# Altium project MB1180.PrjPCB
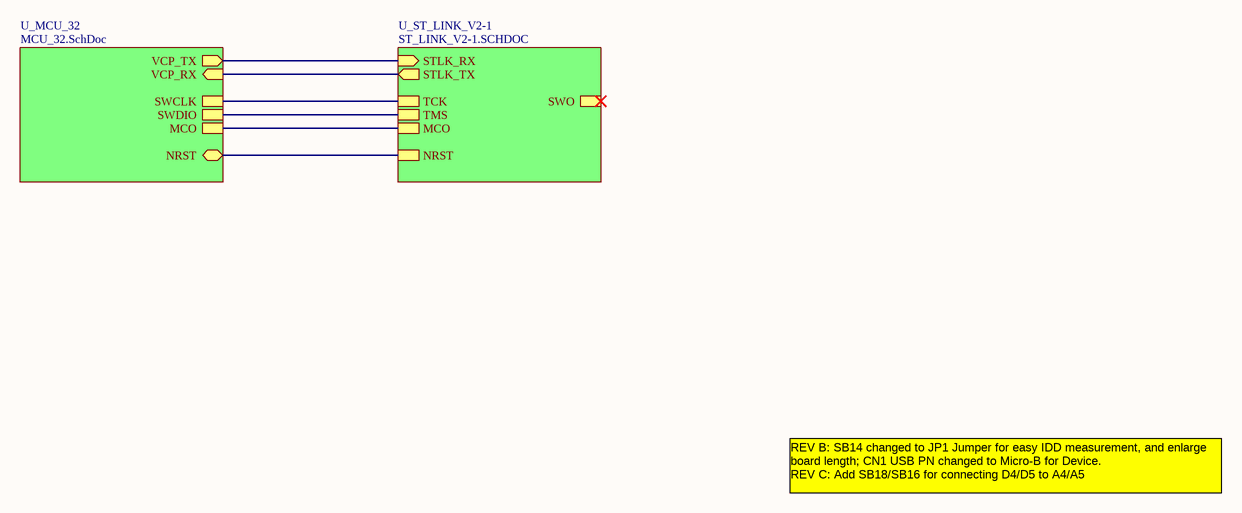
[diagram p0: MB1180.SchDoc]
3 sheets, 89 parts. Net scope: hierarchical (ports join the sheet entries above them; power ports are global).
Board file: MB1180.PcbDoc
Sheets:
  MB1180.SchDoc
    U_MCU_32 = MCU_32.SchDoc
    U_ST_LINK_V2-1 = ST_LINK_V2-1.SCHDOC

## Sheet MB1180.SchDoc: TOP
size A4; DocumentNumber: MB1180; Revision: C.1; SheetNumber: 1; SheetTotal: 3; Project: NUCLEO32

### Sub-sheets
U_MCU_32 = MCU_32.SchDoc: MCO, VCP_TX (out), SWCLK, SWDIO, VCP_RX (in), NRST
U_ST_LINK_V2-1 = ST_LINK_V2-1.SCHDOC: TMS, TCK, MCO, NRST, STLK_RX (in), STLK_TX (out), SWO

### Nets
MCO: sheet U_MCU_32/MCO, sheet U_ST_LINK_V2-1/MCO
NRST: sheet U_MCU_32/NRST, sheet U_ST_LINK_V2-1/NRST
PA2: sheet U_MCU_32/VCP_TX, sheet U_ST_LINK_V2-1/STLK_RX
PA13: sheet U_MCU_32/SWDIO, sheet U_ST_LINK_V2-1/TMS
PA14: sheet U_MCU_32/SWCLK, sheet U_ST_LINK_V2-1/TCK
PA15: sheet U_MCU_32/VCP_RX, sheet U_ST_LINK_V2-1/STLK_TX

### Notes on the sheet
- REV B: SB14 changed to JP1 Jumper for easy IDD measurement, and enlarge board length; CN1 USB PN changed to Micro-B for Device.
  REV C: Add SB18/SB16 for connecting D4/D5 to A4/A5
- Title:
- Project:
- Size:
- Date:
- A4
- Reference:
- Sheet:
- Revision:
- of

## Sheet MCU_32.SchDoc: MCU
size A4; DocumentNumber: MB1180; Revision: C.1; SheetNumber: 2; SheetTotal: 3; Project: NUCLEO32
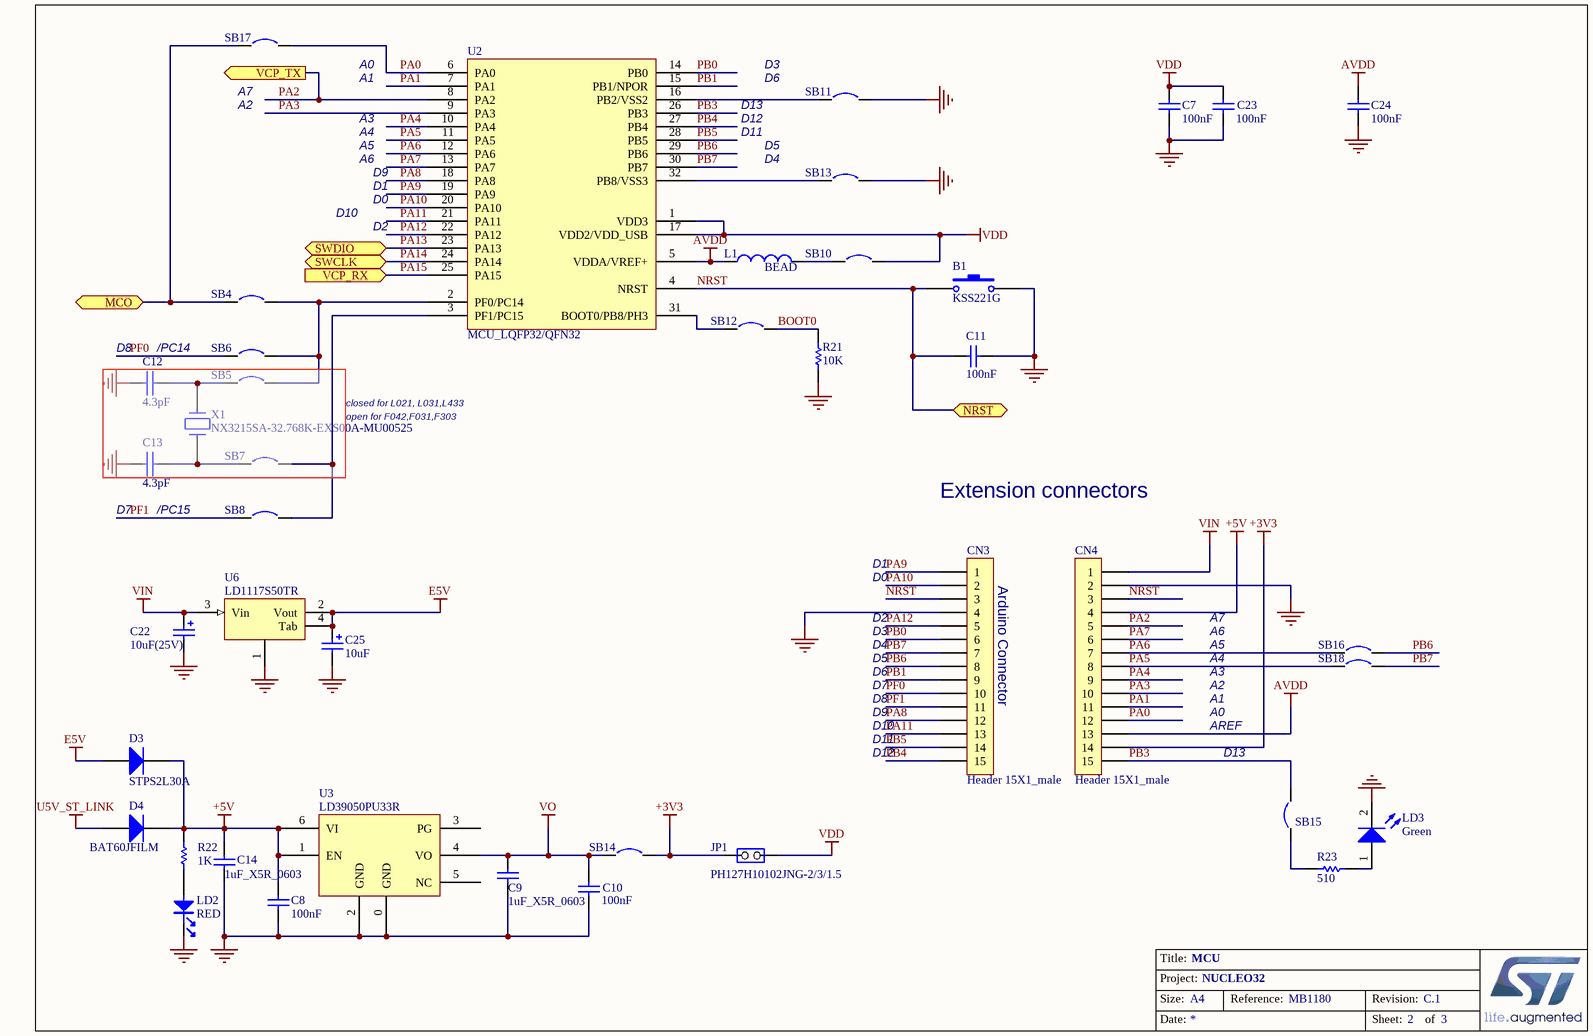
[diagram p1: MCU_32.SchDoc]

### Parts
B1  KSS221G  [SW2_5R6_5R5x3R1]
C7  100nF  [0603C]
C8  100nF  [0603C]
C9  1uF_X5R_0603  [0603C]
C10  100nF  [0603C]
C11  100nF  [0603C]
C12  4.3pF  [0603C]
C13  4.3pF  [0603C]
C14  1uF_X5R_0603  [0603C]
C22  10uF(25V)  [TAN_B]
C23  100nF  [0603C]
C24  100nF  [0603C]
C25  10uF  [TAN_A]
CN3  Header 15X1_male  [HDR_1x15_2R54_V_F]
CN4  Header 15X1_male  [HDR_1x15_2R54_V_F]
D3  STPS2L30A  [SMA]
D4  BAT60JFILM  [SOD-323]
JP1  PH127H10102JNG-2/3/1.5  [HDR_1x2_1R27_R_M]
L1  BEAD  [0603L]
LD2  RED  [0603D_R]
LD3  Green  [0603D_G]
R21  10K  [0603R]
R22  1K  [0603R]
R23  510  [0603R]
SB4  Circuit Breaker (open)  [SB_0603]  (value not drawn)
SB5  Circuit Breaker  [SB_0603]  (value not drawn)
SB6  Circuit Breaker  [SB_0603]  (value not drawn)
SB7  Circuit Breaker  [SB_0603]  (value not drawn)
SB8  Circuit Breaker  [SB_0603]  (value not drawn)
SB10  Circuit Breaker (close)  [SB_0603]  (value not drawn)
SB11  Circuit Breaker (close)  [SB_0603]  (value not drawn)
SB12  Circuit Breaker (close)  [SB_0603]  (value not drawn)
SB13  Circuit Breaker (close)  [SB_0603]  (value not drawn)
SB14  Circuit Breaker (close)  [SB_0603]  (value not drawn)
SB15  Circuit Breaker (close)  [SB_0603]  (value not drawn)
SB16  Circuit Breaker (close)  [SB_0603]  (value not drawn)
SB17  Circuit Breaker (open)  [SB_0603]  (value not drawn)
SB18  Circuit Breaker (close)  [SB_0603]  (value not drawn)
U2  MCU_LQFP32/QFN32  [LQFP32_0R5_7x7]
U3  LD39050PU33R  [DFN6_0R95_3x3_TP]
U6  LD1117S50TR  [SOT-223]
X1  NX3215SA-32.768K-EXS00A-MU00525  [XTAL_2SM_3R2X1R5]

### Ports
MCO, NRST, SWCLK, SWDIO, VCP_RX (in), VCP_TX (out)

### Nets
+3V3: CN4.14 JP1.1(COMMON) SB14.2
+5V: C8.2 C14.1 CN4.4 D3.2(K) D4.2(K) R22.2 U3.1(EN) U3.6(VI)
AVDD: C24.1 CN4.13 L1.1 U2.5(VDDA/VREF+)
E5V: C25.1 D3.1(A) U6.2(Vout) U6.4(Tab)
GND: B1.2 C7.2 C8.1 C9.2 C10.1 C11.1 C12.2 C13.2 C14.2 C22.2 C23.2 C24.2 C25.2 CN3.4 CN4.2 LD2.2 LD3.2(K) R21.2 SB11.2 SB13.2 U3.0(GND) U3.2(GND) U6.1
U5V_ST_LINK: D4.1(A)
VDD: C7.1 C23.1 JP1.2(NO) SB10.2 U2.1(VDD3) U2.17(VDD2/VDD_USB)
VIN: C22.1 CN4.1 U6.3(Vin)
VO: C9.1 C10.2 SB14.1 U3.4(VO)
BOOT0: R21.1 SB12.2
MCO: SB4.1 SB17.1 ; port MCO
NRST: B1.1 C11.2 CN3.3 CN4.3 U2.4(NRST) ; port NRST
PA0: CN4.12 SB17.2 U2.6(PA0)
PA1: CN4.11 U2.7(PA1)
PA2: CN4.5 U2.8(PA2) ; port VCP_TX
PA3: CN4.10 U2.9(PA3)
PA4: CN4.9 U2.10(PA4)
PA5: CN4.8 SB18.1 U2.11(PA5)
PA6: CN4.7 SB16.1 U2.12(PA6)
PA7: CN4.6 U2.13(PA7)
PA8: CN3.12 U2.18(PA8)
PA9: CN3.1 U2.19(PA9)
PA10: CN3.2 U2.20(PA10)
PA11: CN3.13 U2.21(PA11)
PA12: CN3.5 U2.22(PA12)
PA13: U2.23(PA13) ; port SWDIO
PA14: U2.24(PA14) ; port SWCLK
PA15: U2.25(PA15) ; port VCP_RX
PB0: CN3.6 U2.14(PB0)
PB1: CN3.9 U2.15(PB1/NPOR)
PB3: CN4.15 SB15.2 U2.26(PB3)
PB4: CN3.15 U2.27(PB4)
PB5: CN3.14 U2.28(PB5)
PB6: CN3.8 SB16.2 U2.29(PB6)
PB7: CN3.7 SB18.2 U2.30(PB7)
PF0: CN3.10 SB6.1
PF1: CN3.11 SB8.1
NetC12_1: C12.1 SB5.1 X1.1
NetC13_1: C13.1 SB7.1 X1.2
NetL1_2: L1.2 SB10.1
NetLD2_1: LD2.1 R22.1
NetLD3_1: LD3.1(A) R23.1
NetR23_2: R23.2 SB15.1
NetSB4_2: SB4.2 SB5.2 SB6.2 U2.2(PF0/PC14)
NetSB7_2: SB7.2 SB8.2 U2.3(PF1/PC15)
NetSB11_1: SB11.1 U2.16(PB2/VSS2)
NetSB12_1: SB12.1 U2.31(BOOT0/PB8/PH3)
NetSB13_1: SB13.1 U2.32(PB8/VSS3)

Not connected (* = marked no-connect by the designer): U3 3(PG) 5(NC)

### Notes on the sheet
- A2
- (near SB17) A7
- A0
- A1
- D3
- (near SB11) D13
- D6
- A3
- A5
- A6
- A4
- D9
- D4
- D11
- D12
- D5
- D10
- D0
- D1
- D2
- (near C12) D8
- (near C12) /PC14
- closed for L021, L031,L433
- open for F042,F031,F303
- (near C13) D7
- /PC15
- Extension connectors
- (near CN3) Arduino Connector
- A7
- D7
- D8
- AREF
- D13
- Title:
- Project:
- Size:
- Date:
- Reference:
- Sheet:
- Revision:
- of

### Library data of the parts
B1 = SW-PB: Switch; Published: 24-Mar-1999; LatestRevisionDate: 17-Jul-2002; LatestRevisionNote: Re-released for DXP Platform.; PackageReference: SPST-2; Publisher: Altium Limited
C7 C23 C24 = Cap: Capacitor; Value: 10nF; Published: 8-Jun-2000; Revision: July-2002: Re-released for DXP Platform.; Publisher: Altium Limited
C8 C10 = Capacitor_ST: Capacitor 0402 / 0603 / 0805; Revision: July-2002: Re-released for DXP Platform.; Value: 100nF
C9 C14 = CAP SMD 0603  X5R 1µF 25V 10%: 0603  X5R 1µF; Rated voltage: 25V; Tolerance: 10%; Manufacturer: *; Manufacturer P/N: *; Order code Farnell: 1288202RL; Value: 1µF; Power: *; Technology: X5R; Temperature  Factor: *; Temperature Max: +125°C; Temperature Min: -55°C; STS Code: *
C11 = CAP: Capacitor; Value: 100pF; Published: 8-Jun-2000; Revision: July-2002: Re-released for DXP Platform.; Publisher: Altium Limited
C12 C13 = CAP: Capacitor
C22 C25 = Cap Pol1: Polarized Capacitor (Radial); Published: 8-Jun-2000; Revision: July-2002: Re-released for DXP Platform.; Publisher: Altium Limited; Value: 10uF
CN3 CN4 = Header 15X1_Female_1: Header, 10-Pin, Single row,female; LatestRevisionDate: 17-Jul-2002; LatestRevisionNote: Re-released for DXP Platform.; Publisher: Altium Limited
D3 = STPS2L30A: Manuf_1: STM; Provided: ST; Order: BAT60JFILM; ECCN_US/EU: EAR99/NEC; Revision: July-2002: Re-released for DXP Platform.; Manuf_Part_1: BAT60JFILM; Distrib: ST
D4 = BAT60JFILM: Manuf_1: STM; Provided: ST; ECCN_US/EU: EAR99/NEC; Revision: July-2002: Re-released for DXP Platform.; Order: BAT60JFILM; Manuf_Part_1: BAT60JFILM; Distrib: ST
JP1 = JP2
L1 = Inductor: Value: 100uH; Published: 8-Jun-2000; Revision: July-2002: Re-released for DXP Platform.; Publisher: Altium Limited
LD2 = PHOTO
LD3 = LED2: Typical RED, GREEN, YELLOW, AMBER GaAs LED; Published: 8-Jun-2000; Revision: July-2002: Re-released for DXP Platform.; Publisher: Altium Limited
R21 = res1: Resistor; Value: 1K; Published: 8-Jun-2000; Revision: July-2002: Re-released for DXP Platform.; Publisher: Altium Limited
R22 = Resistor_ST: Resistor 0402 / 0603 / 0805; Description: Resistor 0402 or 0603 or 0805; Value: 10K
R23 = Res1: Resistor; Value: 1K; Published: 8-Jun-2000; Revision: July-2002: Re-released for DXP Platform.; Publisher: Altium Limited
SB4-SB8 SB10-SB18 = Circuit Breaker: Solder: NO; Published: 24-Mar-1999; Revision: July-2002: Re-released for DXP Platform.; Publisher: Altium Limited
U2 = MCU_LQFP32
U3 = LD39050P
U6 = LD1117
X1 = CRYSTAL_32K: Crystal

## Sheet ST_LINK_V2-1.SCHDOC: STLINK/V2-1
size A4; DocumentNumber: MB1180; Revision: C.1; SheetNumber: 3; SheetTotal: 3; Project: NUCLEO32
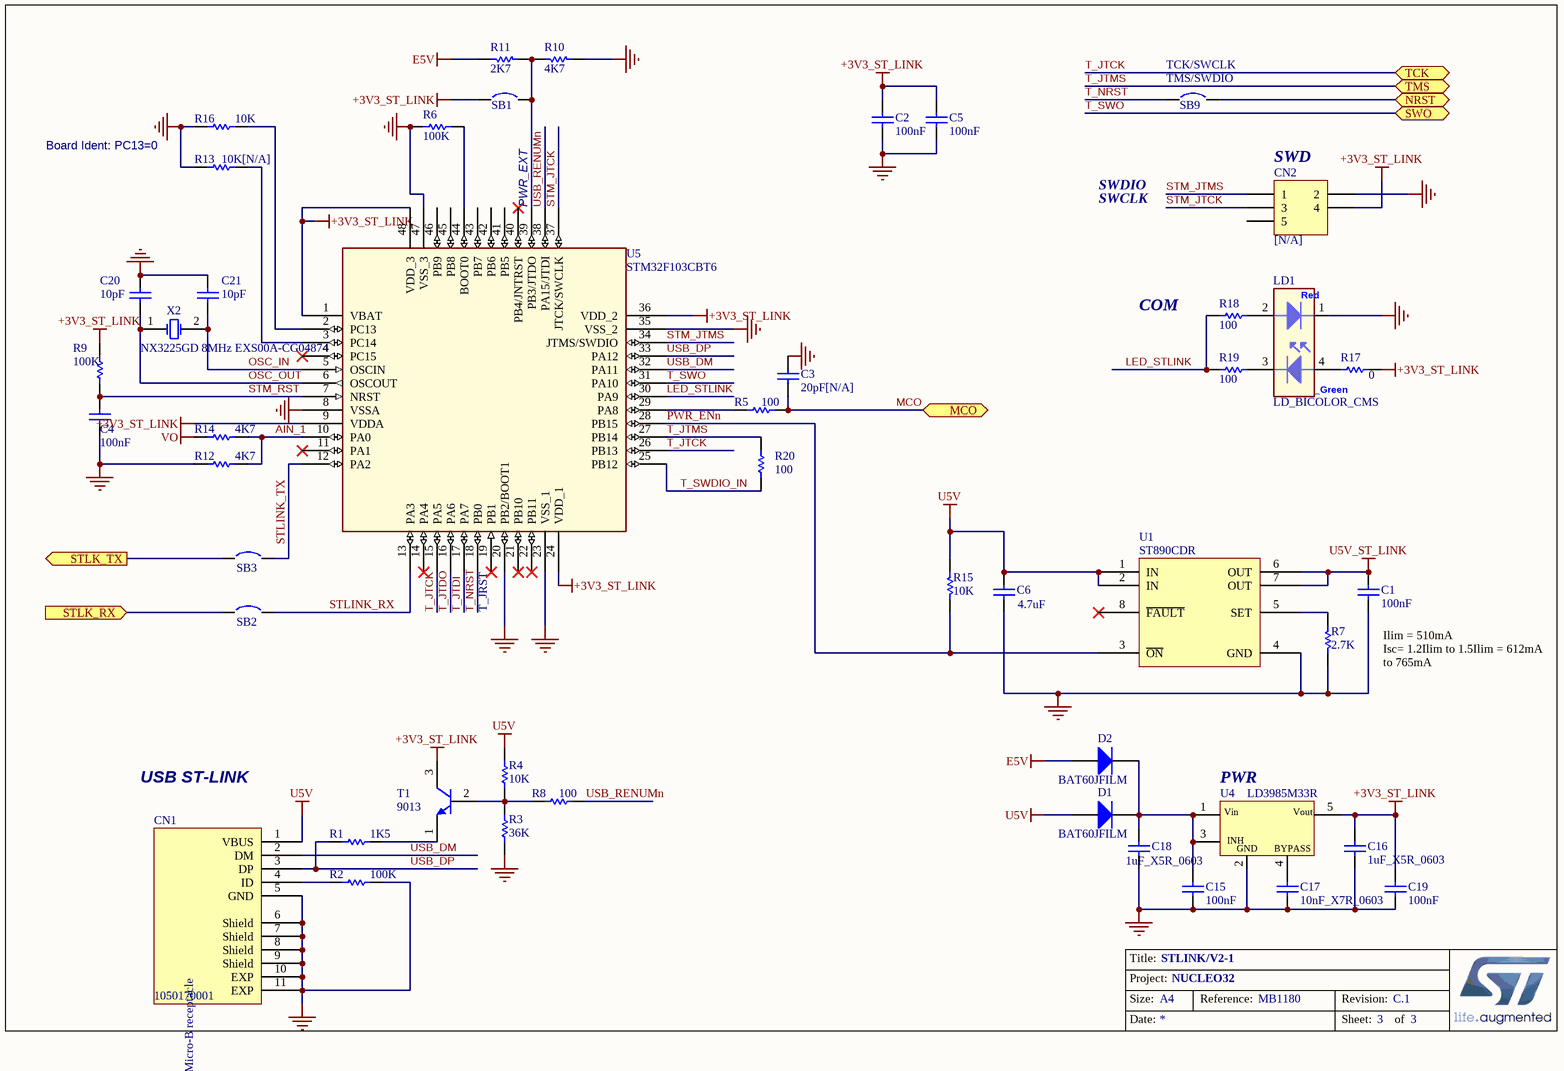
[diagram p2: ST_LINK_V2-1.SCHDOC]

### Parts
C1  100nF  [0603C]
C2  100nF  [0603C]
C3  20pF[N/A]  [0603C]
C4  100nF  [0603C]
C5  100nF  [0603C]
C6  4.7uF  [0603C]
C15  100nF  [0603C]
C16  1uF_X5R_0603  [0603C]
C17  10nF_X7R_0603  [0603C]
C18  1uF_X5R_0603  [0603C]
C19  100nF  [0603C]
C20  10pF  [0603C]
C21  10pF  [0603C]
CN1  1050170001  [Molex_1050170001]
CN2  [N/A]  [HDR_1x5_2R54_V_M]
D1  BAT60JFILM  [SOD-323]
D2  BAT60JFILM  [SOD-323]
LD1  LD_BICOLOR_CMS  [HSMF-A201]
R1  1K5  [0603R]
R2  100K  [0603R]
R3  36K  [0603R]
R4  10K  [0603R]
R5  100  [0603R]
R6  100K  [0603R]
R7  2.7K  [0603R]
R8  100  [0603R]
R9  100K  [0603R]
R10  4K7  [0603R]
R11  2K7  [0603R]
R12  4K7  [0603R]
R13  10K[N/A]  [0603R]
R14  4K7  [0603R]
R15  10K  [0603R]
R16  10K  [0603R]
R17  0  [0603R]
R18  100  [0603R]
R19  100  [0603R]
R20  100  [0603R]
SB1  Circuit Breaker (open)  [SB_0603]  (value not drawn)
SB2  Circuit Breaker (close)  [SB_0603]  (value not drawn)
SB3  Circuit Breaker (close)  [SB_0603]  (value not drawn)
SB9  Circuit Breaker (close)  [SB_0603]  (value not drawn)
T1  9013  [SOT23-3]
U1  ST890CDR  [SO-8]
U4  LD3985M33R  [SOT23-5L]
U5  STM32F103CBT6  [LQFP48_0R5_7x7]
X2  NX3225GD 8MHz EXS00A-CG04874  [XTAL_2SM_3R2x2R5]

### Ports
MCO, NRST, STLK_RX (in), STLK_TX (out), SWO, TCK, TMS

### Nets
+3V3_ST_LINK: C2.2 C5.2 C16.1 C19.2 CN2.4 R9.2 R17.2 SB1.1 T1.3(C) U4.5(Vout) U5.1(VBAT) U5.9(VDDA) U5.24(VDD_1) U5.36(VDD_2) U5.48(VDD_3)
E5V: D2.1(A) R11.1
GND: C1.1 C2.1 C3.2 C4.1 C5.1 C6.1 C15.1 C16.2 C17.1 C18.1 C19.1 C20.2 C21.2 CN1.5(GND) CN1.6(Shield) CN1.7(Shield) CN1.8(Shield) CN1.9(Shield) CN1.10(EXP) CN1.11(EXP) CN2.2 LD1.1 R2.2 R3.1 R6.1 R7.2 R10.2 R12.1 R13.1 R16.1 U1.4(GND) U4.2(GND) U5.8(VSSA) U5.20(PB2/BOOT1) U5.23(VSS_1) U5.35(VSS_2) U5.47(VSS_3)
U5V: C6.2 CN1.1(VBUS) D1.1(A) R4.2 R15.1 U1.1(IN) U1.2(IN)
U5V_ST_LINK: C1.2 U1.6(OUT) U1.7(OUT)
VO: R14.1
AIN_1: R12.2 R14.2 U5.10(PA0)
LED_STLINK: R18.1 R19.1 U5.30(PA9)
MCO: C3.1 R5.2 ; port MCO
NRST: SB9.2 ; port NRST
OSC_IN: C21.1 U5.5(OSCIN) X2.2(OSC2)
OSC_OUT: C20.1 U5.6(OSCOUT) X2.1(OSC1)
PA2: SB2.1 ; port STLK_RX
PA15: SB3.1 ; port STLK_TX
PWR_ENn: R15.2 U1.3(~{ON}) U5.28(PB15)
STLINK_RX: SB2.2 U5.13(PA3)
STLINK_TX: SB3.2 U5.12(PA2)
STM_JTCK: CN2.3 U5.37(JTCK/SWCLK)
STM_JTMS: CN2.1 U5.34(JTMS/SWDIO)
STM_RST: C4.2 R9.1 U5.7(NRST)
T_JTCK: U5.15(PA5) U5.26(PB13) ; port TCK  [project net PA14]
T_JTDI: U5.17(PA7)
T_JTDO: U5.16(PA6)
T_JTMS: R20.2 U5.27(PB14) ; port TMS  [project net PA13]
T_NRST: SB9.1 U5.18(PB0)
T_SWDIO_IN: R20.1 U5.25(PB12)
T_SWO: U5.31(PA10) ; port SWO
USB_DM: CN1.2(DM) U5.32(PA11)
USB_DP: CN1.3(DP) R1.1 U5.33(PA12)
USB_RENUMn: R8.2 U5.38(PA15/JTDI)
NetC15_2: C15.2 C18.2 D1.2(K) D2.2(K) U4.1(Vin) U4.3(CE)
NetC17_2: C17.2 U4.4(BYPASS)
NetCN1_4: CN1.4(ID) R2.1
NetLD1_2: LD1.2 R18.2
NetLD1_3: LD1.3 R19.2
NetLD1_4: LD1.4 R17.1
NetR1_2: R1.2 T1.1(E)
NetR3_2: R3.2 R4.1 R8.1 T1.2(B)
NetR5_1: R5.1 U5.29(PA8)
NetR6_2: R6.2 U5.44(BOOT0)
NetR7_1: R7.1 U1.5(SET)
NetR10_1: R10.1 R11.2 SB1.2 U5.39(PB3/JTDO)
NetR13_2: R13.2 U5.3(PC14)
NetR16_2: R16.2 U5.2(PC13)

Not connected (* = marked no-connect by the designer): CN2 5; U1 8(~{FAULT})*; U5 4(PC15)* 11(PA1)* 14(PA4)* 19(PB1)* 21(PB10)* 22(PB11)* 40(PB4/JNTRST)* 41(PB5) 42(PB6) 43(PB7) 45(PB8) 46(PB9)

### Notes on the sheet
- (near SB9) TCK/SWCLK
- (near SB9) TMS/SWDIO
- Board Ident: PC13=0
- (near CN2) SWD
- (near U5) PWR_EXT
- SWCLK
- SWDIO
- COM
- (near U5) T_JRST
- (near C1) Ilim = 510mA
  Isc= 1.2Ilim to 1.5Ilim = 612mA to 765mA
- USB ST-LINK
- (near U4) PWR
- Title:
- Project:
- Size:
- Date:
- A4
- Reference:
- Sheet:
- Revision:
- of
- (in symbol 1050170001) USB_Micro-B receptacle
- (in symbol LD3985M33R) INH
- (in symbol LD_BICOLOR_CMS) Red; _Green

### Library data of the parts
C1 C2 C4 C5 C15 C19 = Capacitor_ST: Capacitor 0402 / 0603 / 0805; Revision: July-2002: Re-released for DXP Platform.; Value: 100nF
C3 C20 C21 = Capacitor_ST: Capacitor 0402 / 0603 / 0805; Value: 100nF; Revision: July-2002: Re-released for DXP Platform.
C6 C16 C18 = CAP SMD 0603  X5R 1µF 25V 10%: as C9 on sheet MCU_32; Manufacturer: *; Manufacturer P/N: *; Order code Farnell: 1288202RL; Value: 1µF; Power: *; Technology: X5R; Temperature  Factor: *; Temperature Max: +125°C; Temperature Min: -55°C; STS Code: *
C17 = CAP SMD 0603  X7R 10000PF 50V 10%: 0603  X7R 10NF; Order code RS: 2040779; Rated voltage: 50V; Tolerance: 10%; Order code Farnell: 7569548RL; Value: 10NF; Power: *; Technology: X7R; Temperature Factor: *; Temperature Min: -55°C; Temperature Max: +125°C; STS Code: *
CN1 = 1050170001: Silkscreen: USB
CN2 = Header 3X2: Header, 3-Pin, Dual row; Revision: 17-Jul-2002: Re-released for DXP Platform.; Publisher: Altium Limited
D1 D2 = BAT60JFILM: as D4 on sheet MCU_32; Revision: July-2002: Re-released for DXP Platform.; Order: BAT60JFILM; Manuf_Part_1: BAT60JFILM; Distrib: ST
LD1 = LD_BICOLOR_CMS: Bicolor Led; Manuf_Part_1: HSMF-A201-A00J1; Manuf_1: Avago Technologies; Ref St: xxxxxx; cap_dec: ----; Distrib: RADIOSPARES
R1 R2 R5 R6 R8 R9 R17-R20 = Resistor_ST: as R22 on sheet MCU_32
R3 R4 R10 R11 = Res1: Resistor; Value: 1K; Published: 8-Jun-2000; Revision: July-2002: Re-released for DXP Platform.; Publisher: Altium Limited
R7 R15 = Res1: Resistor; Value: 1K; Ordered by: Subcon; Published: 8-Jun-2000; Revision: July-2002: Re-released for DXP Platform.; Publisher: Altium Limited
R12-R14 = Resistor_ST: Resistor 0402 / 0603 / 0805; Description: Resistor 0402 or 0603 or 0805; Value: 10K; Fitted: NO
R16 = Resistor_ST: Resistor 0402 / 0603 / 0805; Description: Resistor 0402 or 0603 or 0805; Value: 10K
SB1-SB3 SB9 = Circuit Breaker: Solder: NO; Published: 24-Mar-1999; Revision: July-2002: Re-released for DXP Platform.; Publisher: Altium Limited
T1 = NPN: NPN Bipolar Transistor; Code - JEDEC: TO-226-AA; Published: 8-Jun-2000; Revision: July-2002: Re-released for DXP Platform.; Publisher: Altium Limited
U4 = LD3985M33R: Ultra low drop-low noise BiCMOS voltage, regulators low ESR capacitors compatible; Manuf_1: STM; Provided: ST; Ref St: 9176161; ECCN_US/EU: EAR99/NEC; Manuf_Part_1: LD3985M33R; Distrib: ST; Order: LD3985M33R
U5 = STM32F103CBT6: Medium-density performance line ARM-based 32-bit MCU with 64KB Flash; Manuf_Part_1: STM32F103C8T6; Manuf_1: STM; Ref St: 9175981; Provided: ST; ECCN_US/EU: 3A991A2/NEC; Footprint: QFP48 7X7; Distrib: ST; Order: STM32F103C8T6
X2 = XTAL: Crystal Oscillator; Published: 8-Jun-2000; LatestRevisionDate: 17-Jul-2002; LatestRevisionNote: Re-released for DXP Platform.; PackageReference: R38; Publisher: Altium Limited

## Nets that join several sheets
E5V: MCU_32 (C25.1 D3.1 U6.2 U6.4), ST_LINK_V2-1 (D2.1 R11.1)
GND: MCU_32 (23 pins), ST_LINK_V2-1 (37 pins)
U5V_ST_LINK: MCU_32 (D4.1), ST_LINK_V2-1 (C1.2 U1.6 U1.7)
VO: MCU_32 (C9.1 C10.2 SB14.1 U3.4), ST_LINK_V2-1 (R14.1)
MCO: MCU_32 (SB4.1 SB17.1), ST_LINK_V2-1 (C3.1 R5.2)
NRST: MCU_32 (5 pins), ST_LINK_V2-1 (SB9.2)
PA2: MCU_32 (CN4.5 U2.8), ST_LINK_V2-1 (SB2.1)
PA13: MCU_32 (U2.23), ST_LINK_V2-1 (R20.2 U5.27)
PA14: MCU_32 (U2.24), ST_LINK_V2-1 (U5.15 U5.26)
PA15: MCU_32 (U2.25), ST_LINK_V2-1 (SB3.1)